# Altium schematic sheet MFRC522_nfc_simple.SchDoc
size A4
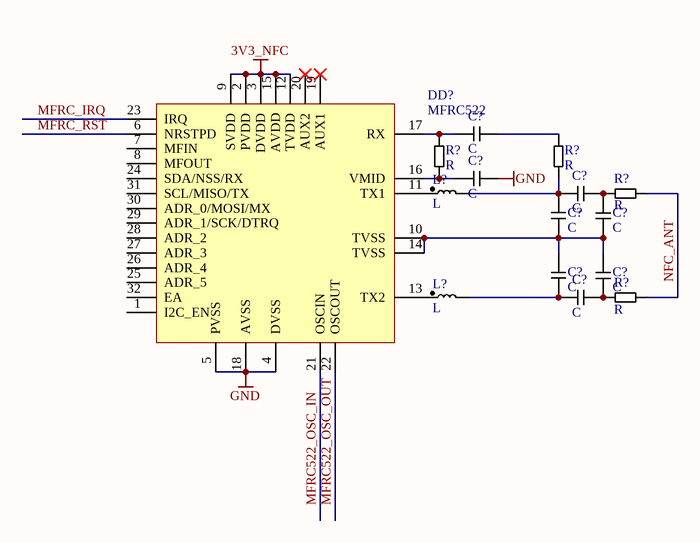
[diagram p0: MFRC522_nfc_simple.SchDoc]

## Parts
(Parts that share a designator on the sheet are numbered #1, #2 ... from top to bottom, then left to right.)
C?#1  C  [C0603]
C?#2  C  [C0603]
C?#3  C  [C0603]
C?#4  C  [C0603]
C?#5  C  [C0603]
C?#6  C  [C0603]
C?#7  C  [C0603]
C?#8  C  [C0603]
DD?  MFRC522  [VFQFPN-32]
L?#1  L  [L0603]
L?#2  L  [L0603]
R?#1  R  [R0603]
R?#2  R  [R0603]
R?#3  R  [R0603]
R?#4  R  [R0603]

## Nets
3V3_NFC: DD?.2(PVDD) DD?.3(DVDD) DD?.9(SVDD) DD?.12(TVDD) DD?.15(AVDD)
GND: C?#2.2 DD?.4(DVSS) DD?.5(PVSS) DD?.18(AVSS)
MFRC522_OSC_IN: DD?.21(OSCIN)
MFRC522_OSC_OUT: DD?.22(OSCOUT)
MFRC_IRQ: DD?.23(IRQ)
MFRC_RST: DD?.6(NRSTPD)
NFC_ANT: R?#3.2 R?#4.2
NetC?#1_1: C?#1.1 DD?.17(RX) R?#1.2
NetC?#1_2: C?#1.2 R?#2.2
NetC?#2_1: C?#2.1 DD?.16(VMID) R?#1.1
NetC?#3_1: C?#3.1 C?#4.1 L?#1.2 R?#2.1
NetC?#3_2: C?#3.2 C?#5.2 R?#3.1
NetC?#4_2: C?#4.2 C?#5.1 C?#6.1 C?#7.2 DD?.10(TVSS) DD?.14(TVSS)
NetC?#6_2: C?#6.2 C?#8.1 L?#2.2
NetC?#7_1: C?#7.1 C?#8.2 R?#4.1
NetDD?_11: DD?.11(TX1) L?#1.1
NetDD?_13: DD?.13(TX2) L?#2.1

Not connected (* = marked no-connect by the designer): DD? 1(I2C_EN) 7(MFIN) 8(MFOUT) 19(AUX1)* 20(AUX2)* 24(SDA/NSS/RX) 25(ADR_5) 26(ADR_4) 27(ADR_3) 28(ADR_2) 29(ADR_1/SCK/DTRQ) 30(ADR_0/MOSI/MX) 31(SCL/MISO/TX) 32(EA)

## Library data of the parts
C?#1-C?#8 = C: Capacitor
DD? = MFRC522: NXP Mifare NFC reader
L?#1 L?#2 = L: Inductor
R?#1-R?#4 = R: Resistor